# Altium schematic sheet Connecteur.SchDoc: TITRE
size Letter; ApprovedBy: APPROUVÉ PAR; Organization: Cegep Limoilou; Address1: 1300, 8e Avenue; Address2: Québec, QC; Address3: Canada; Address4: G1J 5L5; SheetNumber: 2; SheetTotal: 3
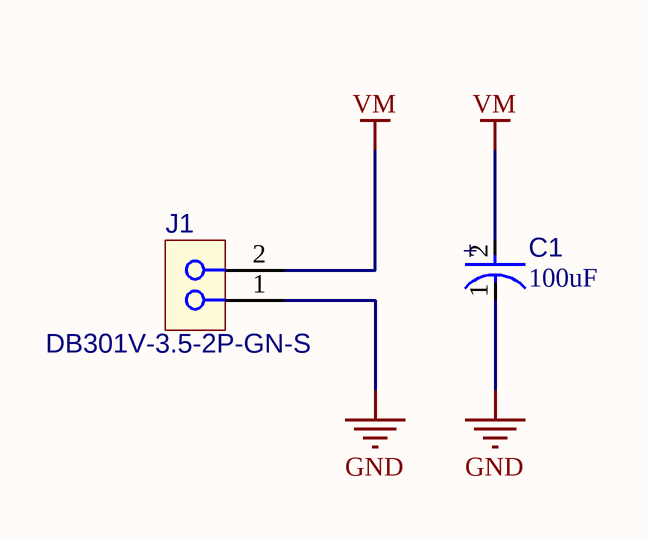
[diagram p0: Connecteur.SchDoc]

## Parts
C1  value 100uF  [C_EL_D10MM-L11MM]  (hidden comment: CAP EL 100uF 63V 10MM)
J1  DB301V-3.5-2P-GN-S  [CONN_TERM_BLOCK_2POS_3mm5]

## Nets
GND: C1.1(C) J1.1
VM: C1.2(A) J1.2

## Notes on the sheet
- Titre :
- Conception :
- Date :
- Approbation :
- Heure :
- Révision :
- Feuille
- de
- Fichier :
- (in symbol CAP021) +

## Library data of the parts
C1 = CAP021: Capacitor type EL; Manufacturer 1: HRK; Manufacturer Part Number 1: GVT1J107M1010CNVC; LibRef: CAP021; Tolerance: 20%; Rated Voltage: 63V; Dielectric: EL; Mounting Technology: SMT; Supplier 1: LCSC; Supplier Part Number 1: C2983410
J1 = CONN-3MM5-2POS-TERM-BLOCK: CONN TERM BLOCK 2POS 3.5mm pitch; Manufacturer 1: Dorabo; Supplier 1: LCSC; Supplier Part Number 1: C695629; Manufacturer Part Number 1: DB301V-3.5-2P-GN-S; Mounting Technology: TH